# Altium schematic sheet 02.SchDoc
size A4
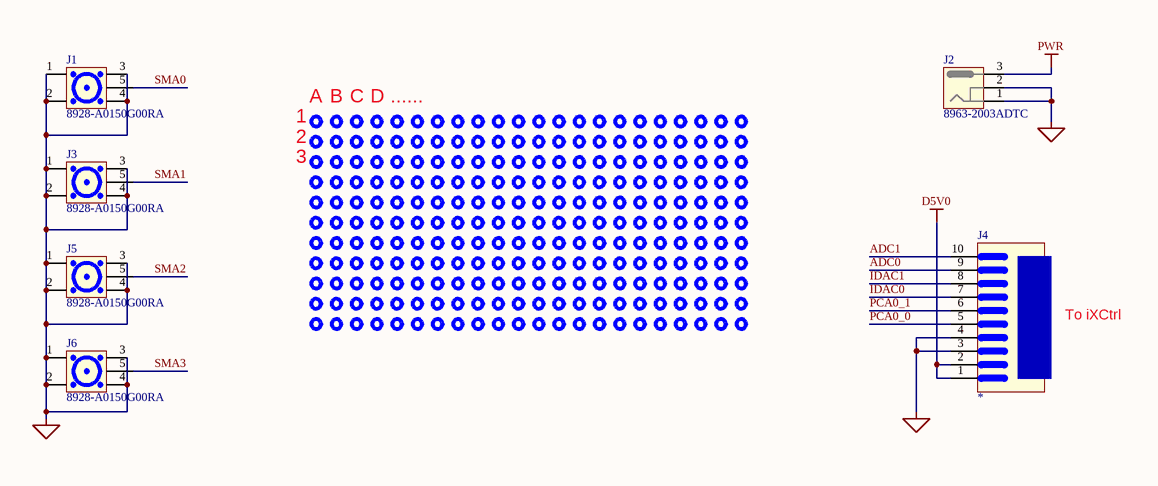
[diagram p0: 02.SchDoc]

## Parts
J1  8928-A0150G00RA  [8928-A0150G00RA]
J2  8963-2003ADTC  [8963-2003ADTC]
J3  8928-A0150G00RA  [8928-A0150G00RA]
J4  *  [FPC0.5mm-10pin]
J5  8928-A0150G00RA  [8928-A0150G00RA]
J6  8928-A0150G00RA  [8928-A0150G00RA]

## Nets
D5V0: J4.1 J4.2
GND: J1.1 J1.2 J1.3 J1.4 J2.1 J2.2 J3.1 J3.2 J3.3 J3.4 J4.3 J4.4 J5.1 J5.2 J5.3 J5.4 J6.1 J6.2 J6.3 J6.4
PWR: J2.3
ADC0: J4.9
ADC1: J4.10
IDAC0: J4.7
IDAC1: J4.8
PCA0_0: J4.5
PCA0_1: J4.6
SMA0: J1.5
SMA1: J3.5
SMA2: J5.5
SMA3: J6.5

## Notes on the sheet
- 1
- A
- B
- C
- D
- ......
- 2
- 3
- To iXCtrl

## Library data of the parts
J1 J3 J5 J6 = 8928-A0150: SMA,female,50ohm,right angle,TH; Manufacturer1: OUPIIN; PartNumberManufacturer1: 8928-A0150G00RA; Manufacturer2: *; PartNumberManufacturer2: *; UnitPrice: *
J2 = 8963-2003: DC jack,2.0mm,SMD; Manufacturer1: OUPIIN; PartNumberManufacturer1: 8963-2003ADTC; Manufacturer2: *; PartNumberManufacturer2: *; UnitPrice: *
J4 = FPC0.5mm_06: FFC socket,10-Pin,bottom contact,0.5mm Pitch,SMD; Manufacturer1: *; Manufacturer2: *; PartNumberManufacturer1: *; PartNumberManufacturer2: *; UnitPrice: *